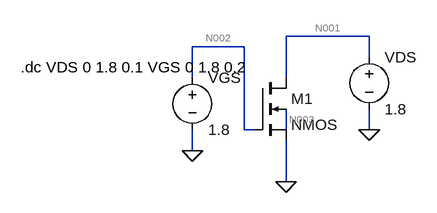
[diagram p0: schematic mosfet.asc]
mosfet.asc, the LTspice schematic file:
Version 4.1
SHEET 1 880 680
WIRE 320 64 192 64
WIRE 128 80 48 80
WIRE 320 96 320 64
WIRE 48 128 48 80
WIRE 192 128 192 64
WIRE 128 208 128 80
WIRE 144 208 128 208
WIRE 192 208 192 176
WIRE 320 208 320 176
WIRE 48 240 48 208
WIRE 192 288 192 224
FLAG 48 240 0
FLAG 320 208 0
FLAG 192 288 0
SYMBOL nmos4 144 128 R0
SYMATTR InstName M1
SYMATTR Value2 l=1000nm w=1000nm
SYMBOL voltage 48 112 R0
WINDOW 123 0 0 Left 0
WINDOW 39 0 0 Left 0
SYMATTR InstName VGS
SYMATTR Value 1.8
SYMBOL voltage 320 80 R0
WINDOW 123 0 0 Left 0
WINDOW 39 0 0 Left 0
SYMATTR InstName VDS
SYMATTR Value 1.8
TEXT -216 112 Left 2 !.dc VDS 0 1.8 0.1 VGS 0 1.8 0.2

The netlist it stands for:
* mosfet.asc
M1 N001 N002 0 N003 NMOS l=1000nm w=1000nm
VGS N002 0 1.8
VDS N001 0 1.8
.model NMOS NMOS
.model PMOS PMOS
.lib standard.mos
.dc VDS 0 1.8 0.1 VGS 0 1.8 0.2
.backanno
.end

* Results of the author's LTspice run, read from the files saved beside the schematic
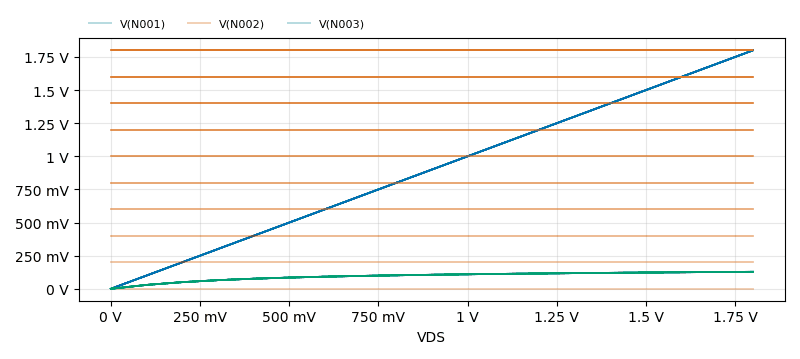
[diagram p1: DC transfer characteristic of mosfet.asc, plotted from the saved traces]
* DC transfer characteristic, 10 runs:
*   V(N001) [VGS=0]: 0 V at VDS=0 V, 1.8 V at VDS=1.8 V, min 0 V, max 1.8 V
*   V(N001) [VGS=0.2]: 0 V at VDS=0 V, 1.8 V at VDS=1.8 V, min 0 V, max 1.8 V
*   V(N001) [VGS=0.4]: 0 V at VDS=0 V, 1.8 V at VDS=1.8 V, min 0 V, max 1.8 V
*   V(N001) [VGS=0.6]: 0 V at VDS=0 V, 1.8 V at VDS=1.8 V, min 0 V, max 1.8 V
*   V(N001) [VGS=0.8]: 0 V at VDS=0 V, 1.8 V at VDS=1.8 V, min 0 V, max 1.8 V
*   V(N001) [VGS=1]: 0 V at VDS=0 V, 1.8 V at VDS=1.8 V, min 0 V, max 1.8 V
*   V(N001) [VGS=1.2]: 0 V at VDS=0 V, 1.8 V at VDS=1.8 V, min 0 V, max 1.8 V
*   V(N001) [VGS=1.4]: 0 V at VDS=0 V, 1.8 V at VDS=1.8 V, min 0 V, max 1.8 V
*   V(N002) [VGS=0]: 0 V at VDS=0 V, 0 V at VDS=1.8 V, min 0 V, max 0 V
*   V(N002) [VGS=0.2]: 200 mV at VDS=0 V, 200 mV at VDS=1.8 V, min 200 mV, max 200 mV
*   V(N002) [VGS=0.4]: 400 mV at VDS=0 V, 400 mV at VDS=1.8 V, min 400 mV, max 400 mV
*   V(N002) [VGS=0.6]: 600 mV at VDS=0 V, 600 mV at VDS=1.8 V, min 600 mV, max 600 mV
*   V(N002) [VGS=0.8]: 800 mV at VDS=0 V, 800 mV at VDS=1.8 V, min 800 mV, max 800 mV
*   V(N002) [VGS=1]: 1 V at VDS=0 V, 1 V at VDS=1.8 V, min 1 V, max 1 V
*   V(N002) [VGS=1.2]: 1.2 V at VDS=0 V, 1.2 V at VDS=1.8 V, min 1.2 V, max 1.2 V
*   V(N002) [VGS=1.4]: 1.4 V at VDS=0 V, 1.4 V at VDS=1.8 V, min 1.4 V, max 1.4 V
*   V(N003) [VGS=0]: 0 V at VDS=0 V, 128.4 mV at VDS=1.8 V, min 0 V, max 128.4 mV
*   V(N003) [VGS=0.2]: 95.37 fV at VDS=0 V, 128.4 mV at VDS=1.8 V, min 95.37 fV, max 128.4 mV
*   V(N003) [VGS=0.4]: 95.37 fV at VDS=0 V, 128.4 mV at VDS=1.8 V, min 95.37 fV, max 128.4 mV
*   V(N003) [VGS=0.6]: 95.37 fV at VDS=0 V, 128.4 mV at VDS=1.8 V, min 95.37 fV, max 128.4 mV
*   V(N003) [VGS=0.8]: 95.37 fV at VDS=0 V, 128.4 mV at VDS=1.8 V, min 95.37 fV, max 128.4 mV
*   V(N003) [VGS=1]: 95.37 fV at VDS=0 V, 128.4 mV at VDS=1.8 V, min 95.37 fV, max 128.4 mV
*   V(N003) [VGS=1.2]: 95.37 fV at VDS=0 V, 128.4 mV at VDS=1.8 V, min 95.37 fV, max 128.4 mV
*   V(N003) [VGS=1.4]: 95.37 fV at VDS=0 V, 128.4 mV at VDS=1.8 V, min 95.37 fV, max 128.4 mV